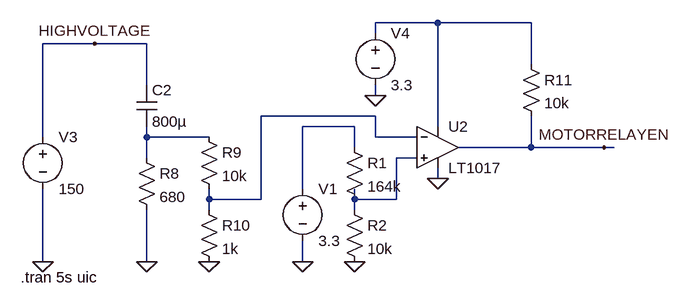
[diagram p0: schematic PrechargeTest (1).asc]
PrechargeTest (1).asc, the LTspice schematic file:
Version 4
SHEET 1 880 964
WIRE -272 -16 -368 -16
WIRE -128 -16 -272 -16
WIRE -368 0 -368 -16
WIRE -800 16 -880 16
WIRE -720 16 -800 16
WIRE -128 48 -128 -16
WIRE -720 80 -720 16
WIRE -368 96 -368 80
WIRE -368 128 -544 128
WIRE -400 144 -480 144
WIRE -272 144 -272 -16
WIRE -880 160 -880 16
WIRE -720 160 -720 144
WIRE -624 160 -720 160
WIRE -368 160 -368 128
WIRE -304 160 -368 160
WIRE -400 176 -400 144
WIRE -128 176 -128 128
WIRE -128 176 -240 176
WIRE -16 176 -128 176
WIRE 0 176 -16 176
WIRE -720 192 -720 160
WIRE -304 192 -336 192
WIRE -272 224 -272 208
WIRE -480 240 -480 144
WIRE -624 256 -624 240
WIRE -544 256 -544 128
WIRE -544 256 -624 256
WIRE -400 256 -400 240
WIRE -336 256 -336 192
WIRE -336 256 -400 256
WIRE -624 272 -624 256
WIRE -400 272 -400 256
WIRE -880 352 -880 240
WIRE -720 352 -720 272
WIRE -480 352 -480 320
FLAG -880 352 0
FLAG -720 352 0
FLAG -624 352 0
FLAG -368 96 0
FLAG -272 224 0
FLAG -800 16 HIGHVOLTAGE
FLAG -16 176 MOTORRELAYEN
FLAG -400 352 0
FLAG -480 352 0
SYMBOL voltage -880 144 R0
WINDOW 123 0 0 Left 0
WINDOW 39 0 0 Left 0
SYMATTR InstName V3
SYMATTR Value 150
SYMBOL cap -736 80 R0
SYMATTR InstName C2
SYMATTR Value 800µ
SYMBOL res -736 176 R0
SYMATTR InstName R8
SYMATTR Value 680
SYMBOL Comparators\\LT1017 -272 176 R0
SYMATTR InstName U2
SYMBOL res -640 144 R0
SYMATTR InstName R9
SYMATTR Value 10k
SYMBOL res -640 256 R0
SYMATTR InstName R10
SYMATTR Value 1k
SYMBOL voltage -368 -16 R0
WINDOW 123 0 0 Left 0
WINDOW 39 0 0 Left 0
SYMATTR InstName V4
SYMATTR Value 3.3
SYMBOL res -144 32 R0
SYMATTR InstName R11
SYMATTR Value 10k
SYMBOL res -416 160 R0
SYMATTR InstName R1
SYMATTR Value 164k
SYMBOL res -416 256 R0
SYMATTR InstName R2
SYMATTR Value 10k
SYMBOL voltage -480 224 R0
WINDOW 123 0 0 Left 0
WINDOW 39 0 0 Left 0
SYMATTR InstName V1
SYMATTR Value 3.3
TEXT -914 376 Left 2 !.tran 5s uic

The netlist it stands for:
* PrechargeTest (1).asc
V3 HIGHVOLTAGE 0 150
C2 HIGHVOLTAGE N004 800µ
R8 N004 0 680
XU2 N005 N002 N001 0 MOTORRELAYEN LT1017  ; pins In+ In- V+ V- OUT
R9 N004 N002 10k
R10 N002 0 1k
V4 N001 0 3.3
R11 N001 MOTORRELAYEN 10k
R1 N003 N005 164k
R2 N005 0 10k
V1 N003 0 3.3
.tran 5s uic
.backanno
.end